# Altium schematic sheet Dash.SchDoc
size 599 x 299 mm
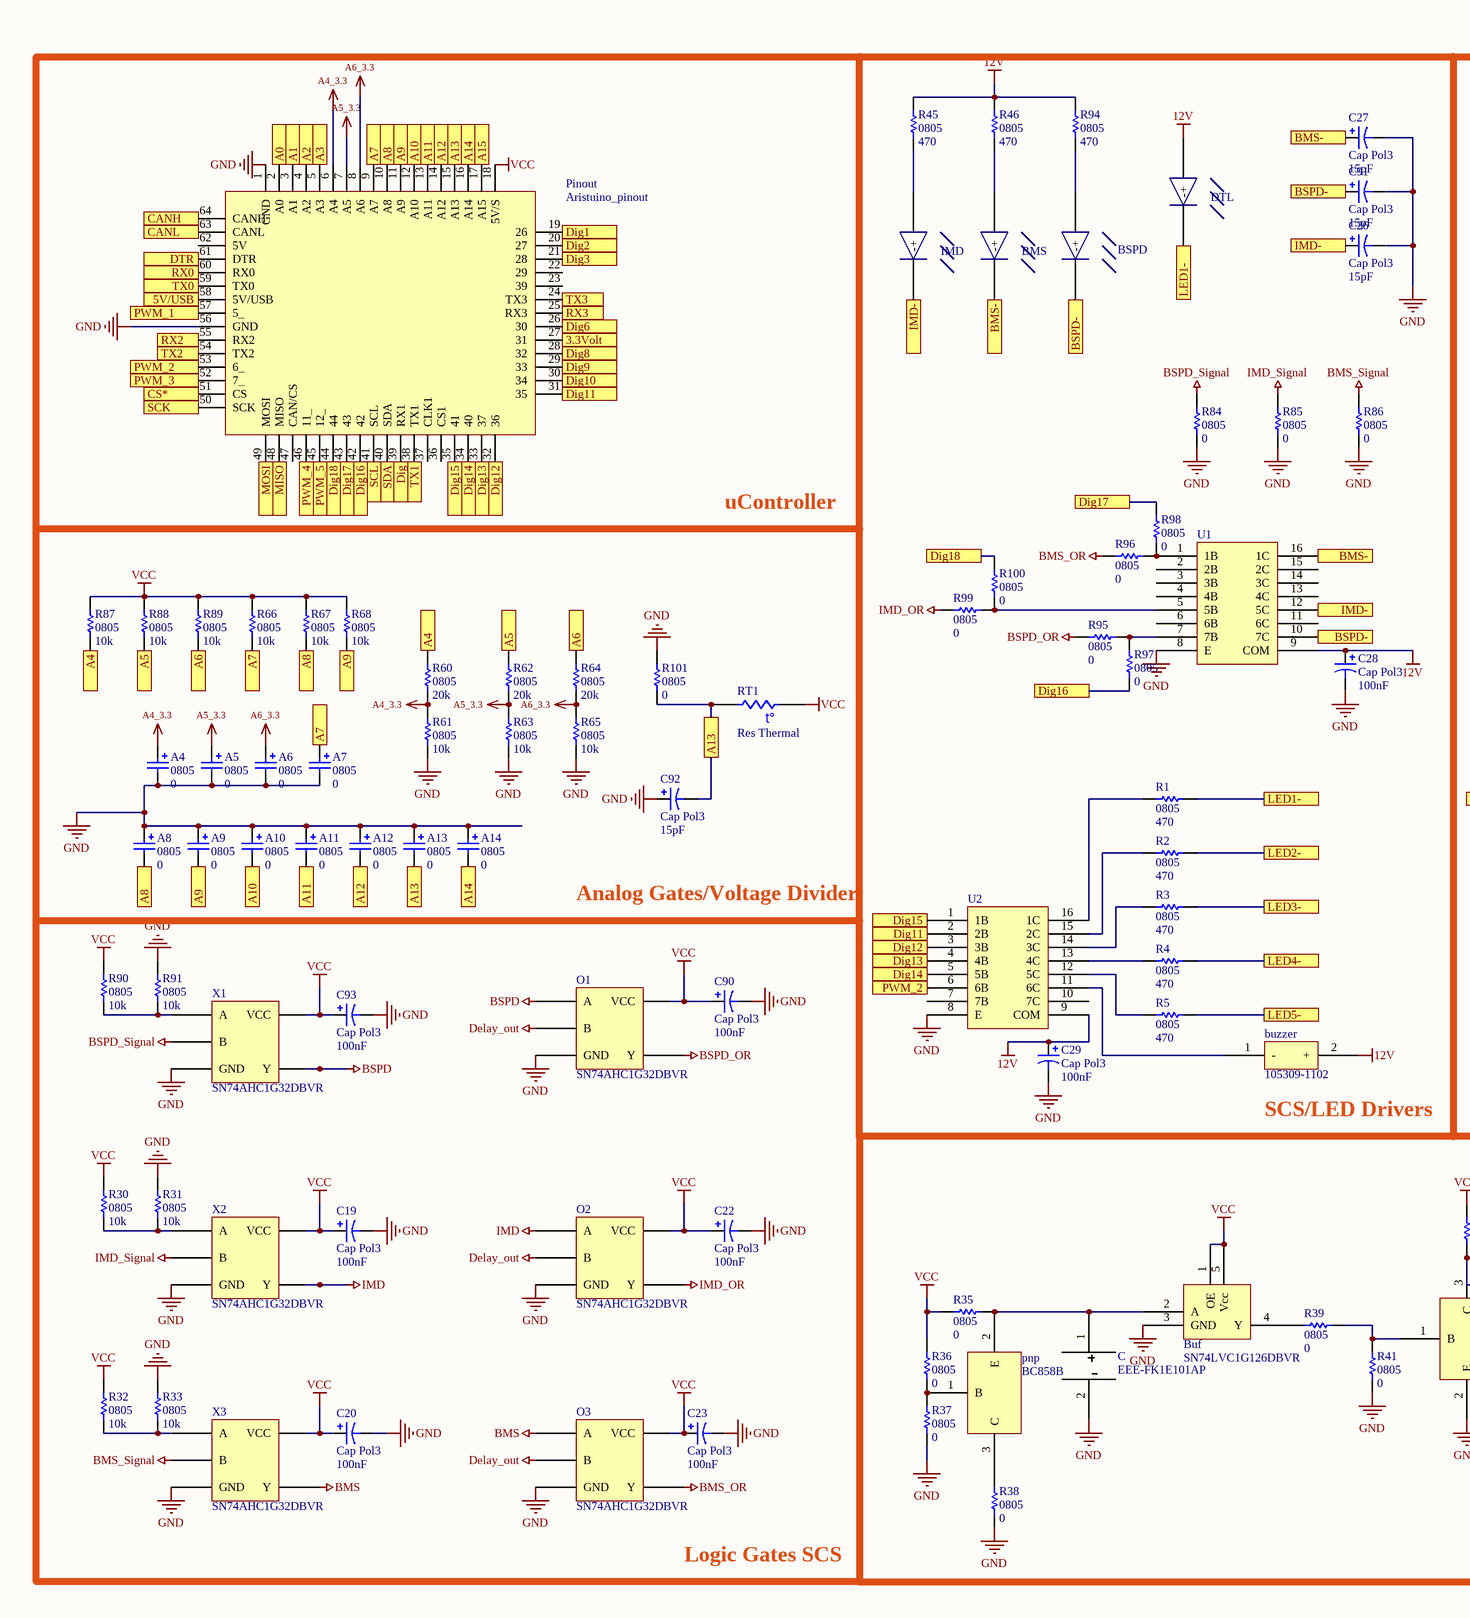
[diagram p0: Dash.SchDoc, left]
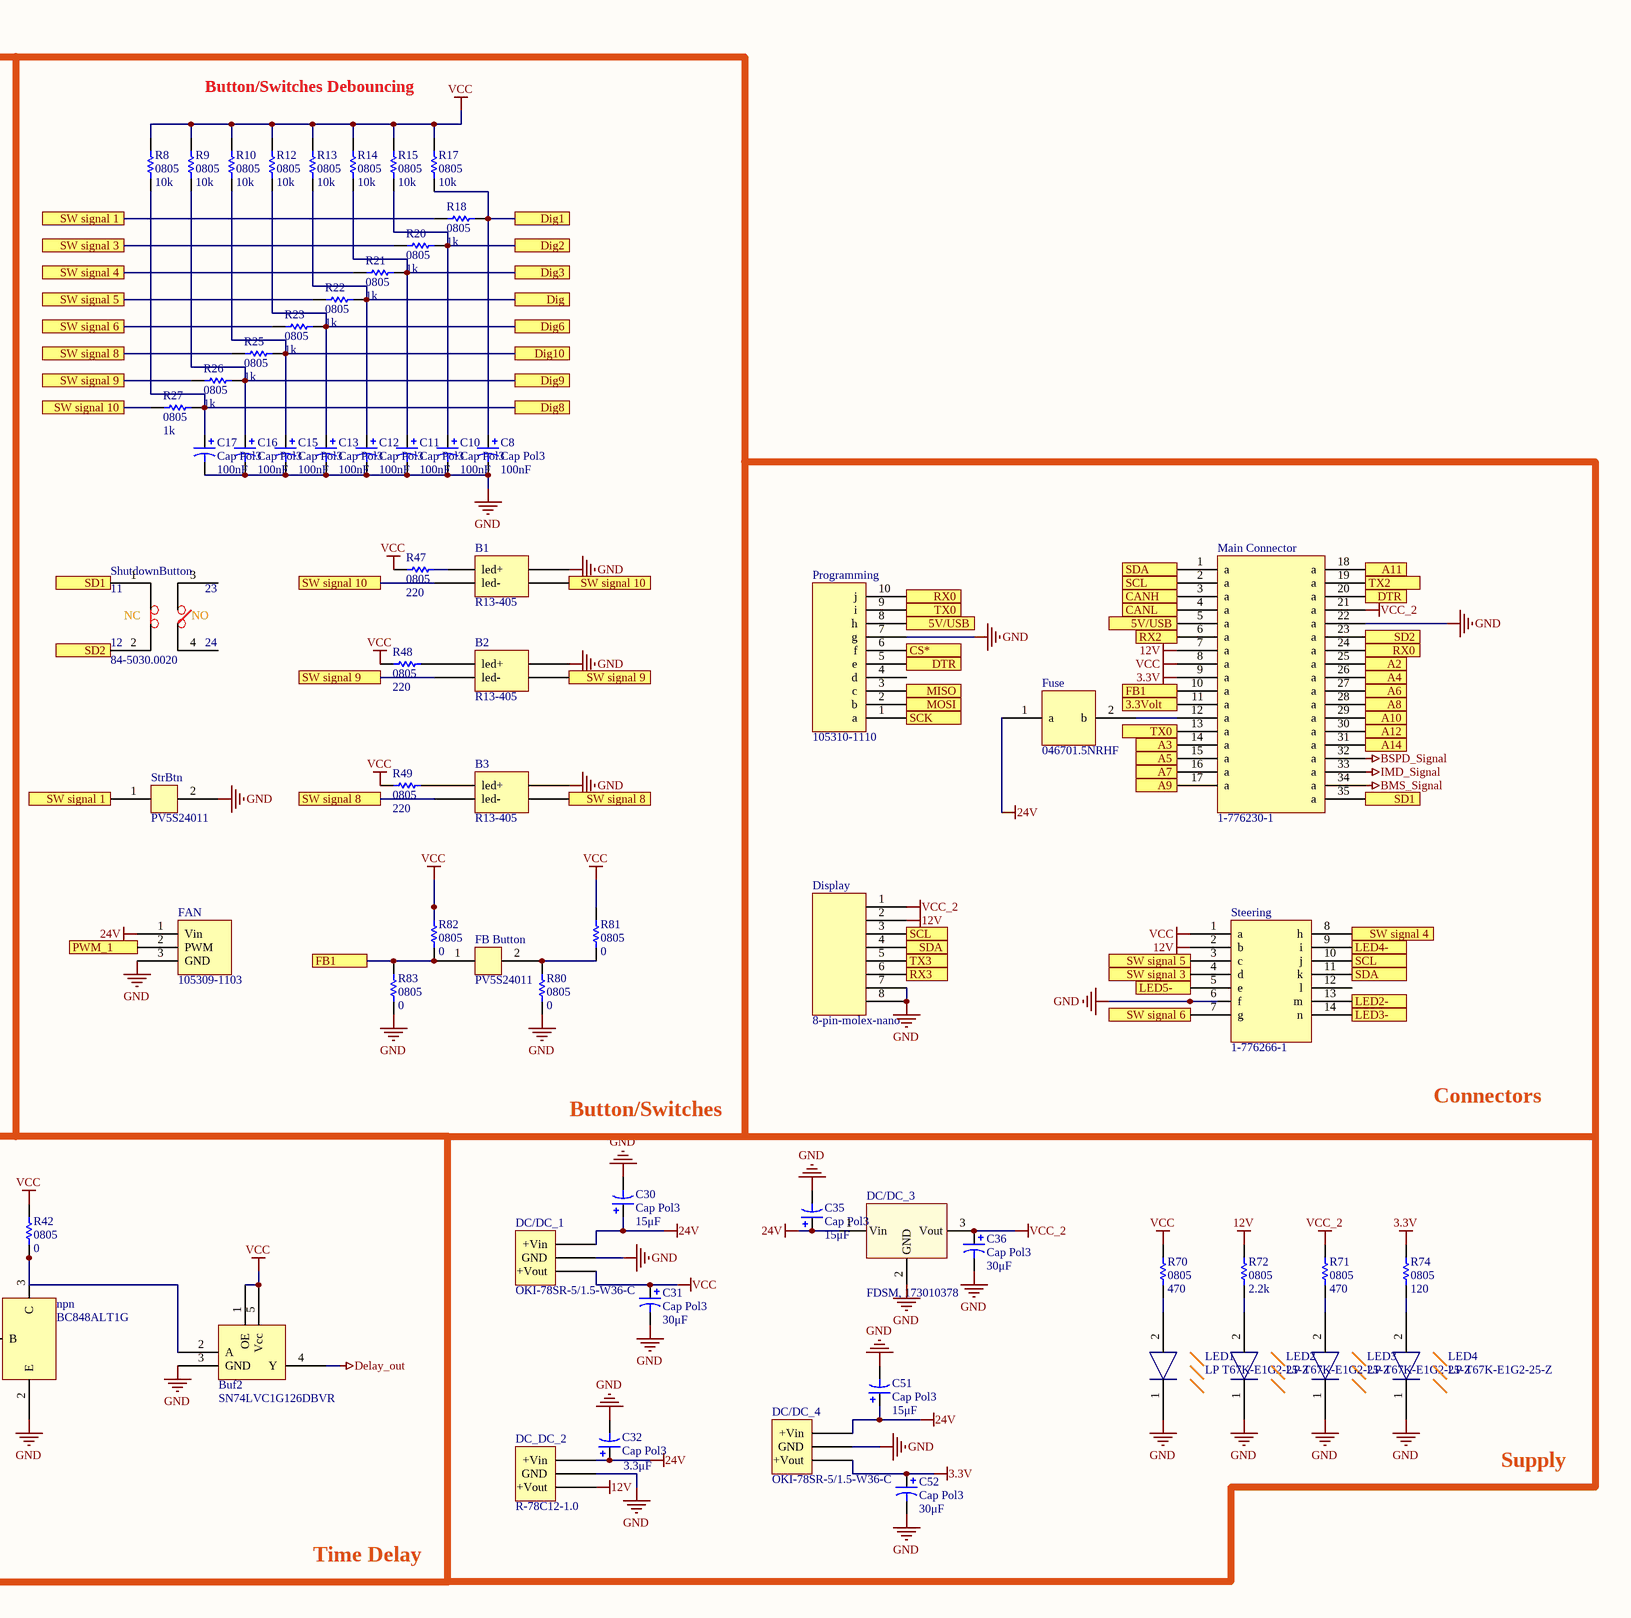
[diagram p1: Dash.SchDoc, right]

## Parts
A4  0805  value 0  [PCBComponent_1]
A5  0805  value 0  [PCBComponent_1]
A6  0805  value 0  [PCBComponent_1]
A7  0805  value 0  [PCBComponent_1]
A8  0805  value 0  [PCBComponent_1]
A9  0805  value 0  [PCBComponent_1]
A10  0805  value 0  [PCBComponent_1]
A11  0805  value 0  [PCBComponent_1]
A12  0805  value 0  [PCBComponent_1]
A13  0805  value 0  [PCBComponent_1]
A14  0805  value 0  [PCBComponent_1]
B1  R13-405  [PCBComponent_1]
B2  R13-405  [PCBComponent_1]
B3  R13-405  [PCBComponent_1]
BMS  LTH3MM12VFR4100  [H_P_LED_?]  (value not drawn)
BSPD  LTH3MM12VFR4100  [H_P_LED_?]  (value not drawn)
Buf  SN74LVC1G126DBVR  [SN74AHC1G32DBVR]
Buf2  SN74LVC1G126DBVR  [SN74AHC1G32DBVR]
buzzer  105309-1102  [PCBComponent_1]
C  EEE-FK1E101AP  [CAPAE7084X65M]
C8  Cap Pol3  value 100nF  [CAPC2012X06N]
C10  Cap Pol3  value 100nF  [CAPC2012X06N]
C11  Cap Pol3  value 100nF  [CAPC2012X06N]
C12  Cap Pol3  value 100nF  [CAPC2012X06N]
C13  Cap Pol3  value 100nF  [CAPC2012X06N]
C15  Cap Pol3  value 100nF  [CAPC2012X06N]
C16  Cap Pol3  value 100nF  [CAPC2012X06N]
C17  Cap Pol3  value 100nF  [CAPC2012X06N]
C19  Cap Pol3  value 100nF  [CAPC2012X06N]
C20  Cap Pol3  value 100nF  [CAPC2012X06N]
C22  Cap Pol3  value 100nF  [CAPC2012X06N]
C23  Cap Pol3  value 100nF  [CAPC2012X06N]
C26  Cap Pol3  value 15pF  [CAPC2012X06N]
C27  Cap Pol3  value 15pF  [CAPC2012X06N]
C28  Cap Pol3  value 100nF  [CAPC2012X06N]
C29  Cap Pol3  value 100nF  [CAPC2012X06N]
C30  Cap Pol3  value 15μF  [CAPC2012X06N]
C31  Cap Pol3  value 30μF  [CAPC2012X06N]
C32  Cap Pol3  value 3.3μF  [CAPC2012X06N]
C35  Cap Pol3  value 15μF  [CAPC2012X06N]
C36  Cap Pol3  value 30μF  [CAPC2012X06N]
C51  Cap Pol3  value 15μF  [CAPC2012X06N]
C52  Cap Pol3  value 30μF  [CAPC2012X06N]
C90  Cap Pol3  value 100nF  [CAPC2012X06N]
C91  Cap Pol3  value 15pF  [CAPC2012X06N]
C92  Cap Pol3  value 15pF  [CAPC2012X06N]
C93  Cap Pol3  value 100nF  [CAPC2012X06N]
DC/DC_1  OKI-78SR-5/1.5-W36-C  [OKI-78SR-5/1.5-W36-C]
DC/DC_3  FDSM, 173010378  [WE-FDSM_173010x78]
DC/DC_4  OKI-78SR-5/1.5-W36-C  [OKI-78SR-5/1.5-W36-C]
DC_DC_2  R-78C12-1.0  [PCBComponent_1]
Display  8-pin-molex-nano  [Molex nano-fit 8pin]
DTL  LTH3MM12VFR4100  [H_P_LED_?]  (value not drawn)
FAN  105309-1103  [FAN?]
FB_Button  PV5S24011  [PV5S24011]
Fuse  046701.5NRHF  [046701.5NRHF]
IMD  LTH3MM12VFR4100  [H_P_LED_?]  (value not drawn)
LED1  LP T67K-E1G2-25-Z  [LP T67K-E1G2-25-Z]
LED2  LP T67K-E1G2-25-Z  [LP T67K-E1G2-25-Z]
LED3  LP T67K-E1G2-25-Z  [LP T67K-E1G2-25-Z]
LED4  LP T67K-E1G2-25-Z  [LP T67K-E1G2-25-Z]
Main_Connector  1-776230-1  [H?]
npn  BC848ALT1G  [NPN BJT]
O1  SN74AHC1G32DBVR  [SN74AHC1G32DBVR]
O2  SN74AHC1G32DBVR  [SN74AHC1G32DBVR]
O3  SN74AHC1G32DBVR  [SN74AHC1G32DBVR]
Pinout  Aristuino_pinout  [18x15 rectangular pin]
pnp  BC858B  [NPN BJT]
Programming  105310-1110  [10pin-molex]
R1  0805  value 470  [RESC2012X06N]
R2  0805  value 470  [RESC2012X06N]
R3  0805  value 470  [RESC2012X06N]
R4  0805  value 470  [RESC2012X06N]
R5  0805  value 470  [RESC2012X06N]
R8  0805  value 10k  [RESC2012X06N]
R9  0805  value 10k  [RESC2012X06N]
R10  0805  value 10k  [RESC2012X06N]
R12  0805  value 10k  [RESC2012X06N]
R13  0805  value 10k  [RESC2012X06N]
R14  0805  value 10k  [RESC2012X06N]
R15  0805  value 10k  [RESC2012X06N]
R17  0805  value 10k  [RESC2012X06N]
R18  0805  value 1k  [RESC2012X06N]
R20  0805  value 1k  [RESC2012X06N]
R21  0805  value 1k  [RESC2012X06N]
R22  0805  value 1k  [RESC2012X06N]
R23  0805  value 1k  [RESC2012X06N]
R25  0805  value 1k  [RESC2012X06N]
R26  0805  value 1k  [RESC2012X06N]
R27  0805  value 1k  [RESC2012X06N]
R30  0805  value 10k  [RESC2012X06N]
R31  0805  value 10k  [RESC2012X06N]
R32  0805  value 10k  [RESC2012X06N]
R33  0805  value 10k  [RESC2012X06N]
R35  0805  value 0  [RESC2012X06N]
R36  0805  value 0  [RESC2012X06N]
R37  0805  value 0  [RESC2012X06N]
R38  0805  value 0  [RESC2012X06N]
R39  0805  value 0  [RESC2012X06N]
R41  0805  value 0  [RESC2012X06N]
R42  0805  value 0  [RESC2012X06N]
R45  0805  value 470  [RESC2012X06N]
R46  0805  value 470  [RESC2012X06N]
R47  0805  value 220  [RESC2012X06N]
R48  0805  value 220  [RESC2012X06N]
R49  0805  value 220  [RESC2012X06N]
R60  0805  value 20k  [RESC2012X06N]
R61  0805  value 10k  [RESC2012X06N]
R62  0805  value 20k  [RESC2012X06N]
R63  0805  value 10k  [RESC2012X06N]
R64  0805  value 20k  [RESC2012X06N]
R65  0805  value 10k  [RESC2012X06N]
R66  0805  value 10k  [RESC2012X06N]
R67  0805  value 10k  [RESC2012X06N]
R68  0805  value 10k  [RESC2012X06N]
R70  0805  value 470  [RESC2012X06N]
R71  0805  value 470  [RESC2012X06N]
R72  0805  value 2.2k  [RESC2012X06N]
R74  0805  value 120  [RESC2012X06N]
R80  0805  value 0  [RESC2012X06N]
R81  0805  value 0  [RESC2012X06N]
R82  0805  value 0  [RESC2012X06N]
R83  0805  value 0  [RESC2012X06N]
R84  0805  value 0  [RESC2012X06N]
R85  0805  value 0  [RESC2012X06N]
R86  0805  value 0  [RESC2012X06N]
R87  0805  value 10k  [RESC2012X06N]
R88  0805  value 10k  [RESC2012X06N]
R89  0805  value 10k  [RESC2012X06N]
R90  0805  value 10k  [RESC2012X06N]
R91  0805  value 10k  [RESC2012X06N]
R94  0805  value 470  [RESC2012X06N]
R95  0805  value 0  [RESC2012X06N]
R96  0805  value 0  [RESC2012X06N]
R97  0805  value 0  [RESC2012X06N]
R98  0805  value 0  [RESC2012X06N]
R99  0805  value 0  [RESC2012X06N]
R100  0805  value 0  [RESC2012X06N]
R101  0805  value 0  [RESC2012X06N]
RT1  Res Thermal  [1608[0603]]
ShutdownButton  84-5030.0020  [ShutDownButton]
Steering  1-776266-1  [PCBComponent_1]
StrBtn  PV5S24011  [PV5S24011]
U1  Darlington Transistors Hi-Vltg Hi-Crnt Darl Transistor Arrays  [ULN2004ADR]  (value not drawn)
U2  Darlington Transistors Hi-Vltg Hi-Crnt Darl Transistor Arrays  [ULN2004ADR]  (value not drawn)
X1  SN74AHC1G32DBVR  [SN74AHC1G32DBVR]
X2  SN74AHC1G32DBVR  [SN74AHC1G32DBVR]
X3  SN74AHC1G32DBVR  [SN74AHC1G32DBVR]

## Ports
3.3Volt, 5V/USB, A0, A1, A2, A3, A4, A5, A6, A7, A8, A9, A10, A11, A12, A13, A14, A15, BMS-, BSPD-, CANH, CANL, CS*, Dig, Dig1, Dig2, Dig3, Dig6, Dig8, Dig9, Dig10, Dig11, Dig12, Dig13, Dig14, Dig15, Dig16, Dig17, Dig18, DTR, FB1, IMD-, LED1-, LED2-, LED3-, LED4-, LED5-, MISO, MOSI, PWM_1, PWM_2, PWM_3, PWM_4, PWM_5, RX0, RX2, RX3, SCK, SCL, SD1, SD2, SDA, SW signal 1, SW signal 3, SW signal 4, SW signal 5, SW signal 6, SW signal 8, SW signal 9, SW signal 10, TX0, TX1, TX2, TX3

## Nets
3.3V: C52.1 DC/DC_4.3(+Vout) Main_Connector.9(a) R74.1
12V: buzzer.2(+) C28.1 C29.1 DC_DC_2.3(+Vout) Display.2 DTL.1(+) Main_Connector.7(a) R45.2 R46.2 R72.1 R94.2 Steering.2(b) U1.9(COM) U2.9(COM)
24V: C30.1 C32.1 C35.1 C51.1 DC/DC_1.1(+Vin) DC/DC_3.1(Vin) DC/DC_4.1(+Vin) DC_DC_2.1(+Vin) FAN.1(Vin) Fuse.1(a)
A4_3.3: A4.1 Pinout.6(A4) R60.2 R61.1
A5_3.3: A5.1 Pinout.7(A5) R62.2 R63.1
A6_3.3: A6.1 Pinout.8(A6) R64.2 R65.1
BMS: O3.1(A) X3.4(Y)
BMS_OR: O3.4(Y) R96.1
BMS_Signal: Main_Connector.34(a) R86.1 X3.2(B)
BSPD: O1.1(A) X1.4(Y)
BSPD_OR: O1.4(Y) R95.1
BSPD_Signal: Main_Connector.32(a) R84.1 X1.2(B)
Delay_out: Buf2.4(Y) O1.2(B) O2.2(B) O3.2(B)
GND: A4.2 A5.2 A6.2 A7.2 A8.1 A9.1 A10.1 A11.1 A12.1 A13.1 A14.1 B1.3 B2.3 B3.3 Buf.3(GND) Buf2.3(GND) C.2 C8.2 C10.2 C11.2 C12.2 C13.2 C15.2 C16.2 C17.2 C19.2 C20.2 C22.2 C23.2 C26.2 C27.2 C28.2 C29.2 C30.2 C31.2 C32.2 C35.2 C36.2 C51.2 C52.2 C90.2 C91.2 C92.1 C93.2 DC/DC_1.2(GND) DC/DC_3.2(GND) DC/DC_4.2(GND) DC_DC_2.2(GND) Display.7 Display.8 FAN.3(GND) LED1.1(+) LED2.1(+) LED3.1(+) LED4.1(+) Main_Connector.22(a) npn.2(E) O1.3(GND) O2.3(GND) O3.3(GND) Pinout.1(GND) Pinout.56(GND) Programming.7(g) R31.1 R33.1 R37.2 R38.2 R41.1 R61.2 R63.2 R65.2 R80.2 R83.2 R84.2 R85.2 R86.2 R91.1 R101.1 Steering.6(f) StrBtn.2 U1.8(E) U2.8(E) X1.3(GND) X2.3(GND) X3.3(GND)
IMD: O2.1(A) X2.4(Y)
IMD_OR: O2.4(Y) R99.2
IMD_Signal: Main_Connector.33(a) R85.1 X2.2(B)
VCC: Buf.1(OE) Buf.5(Vcc) Buf2.1(OE) Buf2.5(Vcc) C19.1 C20.1 C22.1 C23.1 C31.1 C90.1 C93.1 DC/DC_1.3(+Vout) Main_Connector.8(a) O1.5(VCC) O2.5(VCC) O3.5(VCC) Pinout.18(5V/S) R8.2 R9.2 R10.2 R12.2 R13.2 R14.2 R15.2 R17.2 R30.1 R32.1 R35.1 R36.1 R42.1 R47.2 R48.2 R49.2 R66.1 R67.1 R68.1 R70.1 R81.2 R82.2 R87.1 R88.1 R89.1 R90.1 RT1.1 Steering.1(a) X1.5(VCC) X2.5(VCC) X3.5(VCC)
VCC_2: C36.1 DC/DC_3.3(Vout) Display.1 Main_Connector.21(a) R71.1
3.3Volt: Main_Connector.11(a) Pinout.27(31) ; port 3.3Volt
5V/USB: Main_Connector.5(a) Pinout.58(5V/USB) Programming.8(h) ; port 5V/USB
A0: Pinout.2(A0) ; port A0
A1: Pinout.3(A1) ; port A1
A2: Main_Connector.25(a) Pinout.4(A2) ; port A2
A3: Main_Connector.14(a) Pinout.5(A3) ; port A3
A4: Main_Connector.26(a) R60.1 R87.2 ; port A4
A5: Main_Connector.15(a) R62.1 R88.2 ; port A5
A6: Main_Connector.27(a) R64.1 R89.2 ; port A6
A7: A7.1 Main_Connector.16(a) Pinout.9(A7) R66.2 ; port A7
A8: A8.2 Main_Connector.28(a) Pinout.10(A8) R67.2 ; port A8
A9: A9.2 Main_Connector.17(a) Pinout.11(A9) R68.2 ; port A9
A10: A10.2 Main_Connector.29(a) Pinout.12(A10) ; port A10
A11: A11.2 Main_Connector.18(a) Pinout.13(A11) ; port A11
A12: A12.2 Main_Connector.30(a) Pinout.14(A12) ; port A12
A13: A13.2 C92.2 Pinout.15(A13) R101.2 RT1.2 ; port A13
A14: A14.2 Main_Connector.31(a) Pinout.16(A14) ; port A14
A15: Pinout.17(A15) ; port A15
BMS-: BMS.2(-) C27.1 U1.16(1C) ; port BMS-
BSPD-: BSPD.2(-) C91.1 U1.10(7C) ; port BSPD-
CANH: Main_Connector.3(a) Pinout.64(CANH) ; port CANH
CANL: Main_Connector.4(a) Pinout.63(CANL) ; port CANL
CS*: Pinout.51(CS) Programming.6(f) ; port CS*
Dig: C12.1 Pinout.39(RX1) R13.1 R22.1 ; port Dig
Dig1: C8.1 Pinout.19(26) R17.1 R18.1 ; port Dig1
Dig2: C10.1 Pinout.20(27) R15.1 R20.1 ; port Dig2
Dig3: C11.1 Pinout.21(28) R14.1 R21.1 ; port Dig3
Dig6: C13.1 Pinout.26(30) R12.1 R23.1 ; port Dig6
Dig8: C17.1 Pinout.28(32) R8.1 R27.1 ; port Dig8
Dig9: C16.1 Pinout.29(33) R9.1 R26.1 ; port Dig9
Dig10: C15.1 Pinout.30(34) R10.1 R25.1 ; port Dig10
Dig11: Pinout.31(35) U2.2(2B) ; port Dig11
Dig12: Pinout.32(36) U2.3(3B) ; port Dig12
Dig13: Pinout.33(37) U2.4(4B) ; port Dig13
Dig14: Pinout.34(40) U2.5(5B) ; port Dig14
Dig15: Pinout.35(41) U2.1(1B) ; port Dig15
Dig16: Pinout.42 R97.1 ; port Dig16
Dig17: Pinout.43 R98.2 ; port Dig17
Dig18: Pinout.44 R100.1 ; port Dig18
DTR: Main_Connector.20(a) Pinout.61(DTR) Programming.5(e) ; port DTR
FB1: FB_Button.1 Main_Connector.10(a) R82.1 R83.1 ; port FB1
IMD-: C26.1 IMD.2(-) U1.12(5C) ; port IMD-
LED1-: DTL.2(-) R1.2 ; port LED1-
LED2-: R2.2 Steering.13(m) ; port LED2-
LED3-: R3.2 Steering.14(n) ; port LED3-
LED4-: R4.2 Steering.9(i) ; port LED4-
LED5-: R5.2 Steering.5(e) ; port LED5-
MISO: Pinout.48(MISO) Programming.3(c) ; port MISO
MOSI: Pinout.49(MOSI) Programming.2(b) ; port MOSI
PWM_1: FAN.2(PWM) Pinout.57(5_) ; port PWM_1
PWM_2: Pinout.53(6_) U2.6(6B) ; port PWM_2
PWM_3: Pinout.52(7_) ; port PWM_3
PWM_4: Pinout.46(11_) ; port PWM_4
PWM_5: Pinout.45(12_) ; port PWM_5
RX0: Main_Connector.24(a) Pinout.60(RX0) Programming.10(j) ; port RX0
RX2: Main_Connector.6(a) Pinout.55(RX2) ; port RX2
RX3: Display.6 Pinout.25(RX3) ; port RX3
SCK: Pinout.50(SCK) Programming.1(a) ; port SCK
SCL: Display.3 Main_Connector.2(a) Pinout.41(SCL) Steering.10(j) ; port SCL
SD1: Main_Connector.35(a) ShutdownButton.1 ; port SD1
SD2: Main_Connector.23(a) ShutdownButton.2 ; port SD2
SDA: Display.4 Main_Connector.1(a) Pinout.40(SDA) Steering.11(k) ; port SDA
SW signal 1: R18.2 StrBtn.1 ; port SW signal 1
SW signal 3: R20.2 Steering.4(d) ; port SW signal 3
SW signal 4: R21.2 Steering.8(h) ; port SW signal 4
SW signal 5: R22.2 Steering.3(c) ; port SW signal 5
SW signal 6: R23.2 Steering.7(g) ; port SW signal 6
SW signal 8: B3.2(led-) B3.4 R25.2 ; port SW signal 8
SW signal 9: B2.2(led-) B2.4 R26.2 ; port SW signal 9
SW signal 10: B1.2(led-) B1.4 R27.2 ; port SW signal 10
TX0: Main_Connector.13(a) Pinout.59(TX0) Programming.9(i) ; port TX0
TX1: Pinout.38(TX1) ; port TX1
TX2: Main_Connector.19(a) Pinout.54(TX2) ; port TX2
TX3: Display.5 Pinout.24(TX3) ; port TX3
NetB1_1: B1.1(led+) R47.1
NetB2_1: B2.1(led+) R48.1
NetB3_1: B3.1(led+) R49.1
NetBMS_1: BMS.1(+) R46.1
NetBSPD_1: BSPD.1(+) R94.1
NetBuf2_2: Buf2.2(A) npn.3(C) R42.2
NetBuf_2: Buf.2(A) C.1 pnp.2(E) R35.2
NetBuf_4: Buf.4(Y) R39.1
Netbuzzer_1: buzzer.1(-) U2.11(6C)
NetFB_Button_2: FB_Button.2 R80.1 R81.1
NetFuse_2: Fuse.2(b) Main_Connector.12(a)
NetIMD_1: IMD.1(+) R45.1
NetLED1_2: LED1.2(-) R70.2
NetLED2_2: LED2.2(-) R72.2
NetLED3_2: LED3.2(-) R71.2
NetLED4_2: LED4.2(-) R74.2
Netnpn_1: npn.1(B) R39.2 R41.2
Netpnp_1: pnp.1(B) R36.2 R37.1
Netpnp_3: pnp.3(C) R38.1
NetR1_1: R1.1 U2.16(1C)
NetR2_1: R2.1 U2.15(2C)
NetR3_1: R3.1 U2.14(3C)
NetR4_1: R4.1 U2.13(4C)
NetR5_1: R5.1 U2.12(5C)
NetR30_2: R30.2 R31.2 X2.1(A)
NetR32_2: R32.2 R33.2 X3.1(A)
NetR90_2: R90.2 R91.2 X1.1(A)
NetR95_2: R95.2 R97.2 U1.7(7B)
NetR96_2: R96.2 R98.1 U1.1(1B)
NetR99_1: R99.1 R100.2 U1.5(5B)

Not connected (* = marked no-connect by the designer): Pinout 22(29) 23(39) 36(CS1) 37(CLK1) 47(CAN/CS) 62(5V); Programming 4(d); ShutdownButton 3 4; Steering 12(l); U1 2(2B) 3(3B) 4(4B) 6(6B) 11(6C) 13(4C) 14(3C) 15(2C); U2 7(7B) 10(7C)

## Notes on the sheet
- Button/Switches Debouncing
- uController
- Analog Gates/Voltage Divider
- Connectors
- (near buzzer) SCS/LED Drivers
- Button/Switches
- Supply
- Logic Gates SCS
- Time Delay
- (in symbol 84-5030.0020) 11; 23; NC; NO; 12; 24
- (in symbol Res Thermal) t°

## Library data of the parts
A4-A14 = Cap Pol2: Polarized Capacitor (Axial); Published: 8-Jun-2000; LatestRevisionDate: 17-Jul-2002; LatestRevisionNote: Re-released for DXP Platform.; PackageReference: POLAR0.8; Publisher: Altium Limited; PackageDescription: Polarized Capacitor; 2 Leads
B1-B3 O1-O3 U1 U2 X1-X3 = Component_1
BMS BSPD DTL IMD = Component_1: Standard LEDs - Through Hole 3mm Thru Hole LED 625nm for 12VDC
Buf Buf2 = SN74LVC1G126DBVR: Buffers & Line Drivers Single Bus Buffer
buzzer = U: Nano-Fit Vertical Header, Through Hole, 2.50mm Pitch, Single Row, 2 Circuits, with Kinked Pins, Tin (Sn) Plating, Black
C = EEE-FK1E101AP: Aluminium Electrolytic Capacitors - SMD 100UF 25V FK SMD
C8 C10-C13 C15-C17 C19 C20 C22 C23 C26-C32 C35 C36 C51 C52 C90-C93 = Cap Pol3: Polarized Capacitor (Surface Mount); Published: 8-Jun-2000; LatestRevisionDate: 29-May-2009; LatestRevisionNote: IPC-7351 Footprint Added.; PackageReference: C0805; Publisher: Altium Limited; PackageDescription: Chip Capacitor
DC/DC_1 DC/DC_4 = Component_1: Non-Isolated DC/DC Converters 7.5W 24Vin 5Vout1 1.5A SIP Non-Iso
DC/DC_3 = FDSM, 173010378: MagI³C-FDSM Fixed Step Down Regulator Module; InputVoltage: 7-28V; OutputCurrent: 1A; PublishedDate: Aug 2016; Publisher: Wurth Elektronik; ComponentLink1Description: Manufacturer; ComponentLink1URL: http://www.we-online.de; ComponentLink2Description: Datasheet; ComponentLink2URL: http://katalog.we-online.de/pm/datasheet/173010378.pdf; PartNumber: 173010378; Size: SIP-3
DC_DC_2 = Component_1: Non-Isolated DC/DC Converters CONV DC/DC 1A 15-42VIN 12VOUT
FAN = Component_1: Nano-Fit Vertical Header, Through Hole, 2.50mm Pitch, Single Row, 3 Circuits, with Kinked Pins, Tin (Sn) Plating, Black
FB_Button StrBtn = Component_1: Pushbutton Switches 0-2A 48VDC Off (On) 12mm Black Domed
Fuse = 046701.5NRHF: Surface Mount Fuses 32V 1.5 A V/FA HALIDE FREE
LED1-LED4 = Component_1: Standard LEDs - SMD Pure Green, 560nm 2.8mcd, 2mA
Main_Connector = Component_1: HEADER ASSY, 35 POS VERTICAL
npn = Component_1: Bipolar Transistors - BJT 100mA 30V NPN
pnp = Component_1: Bipolar Transistors - BJT Transistor 200mW
Programming = Component_1: Nano-Fit Vertical Header, Through Hole, 2.50mm Pitch, Dual Row, 10 Circuits, with Kinked Pins, Tin (Sn) Plating, Black
R1-R5 R8-R10 R12-R15 R17 R18 R20-R23 R25-R27 R30-R33 R35-R39 R41 R42 R45-R49 R60-R68 R70-R72 R74 R80-R91 R94-R101 = ERJ6RB: Precision Thick Film Chip Resistor, 10 Ohm to 1M Ohm Range, 1% and 0.5% Tolerance, 0805 Size, 0.1 W; Published: 17-Dec-2003; LatestRevisionDate: 19-Mar-2004; LatestRevisionNote: Silkscreen size reduced.; PackageDocument: Mar-2003; PackageReference: 6-0805; Publisher: Altium Limited; Code_IPC: 2012 [0805]; ComponentLink1Description: Manufacturer Link; ComponentLink1URL: http://www.panasonic.com/industrial/components/resistive_products.htm; ComponentLink2Description: Datasheet; ComponentLink2URL: http://www.panasonic.com/industrial/components/pdf/AOA0000CE2.pdf
RT1 = Res Thermal: Thermistor; Published: 24-Mar-1999; LatestRevisionDate: 29-May-2009; LatestRevisionNote: IPC-7351 Footprint Added.; PackageVersion: Mar-2003; PackageReference: 6-0805; Publisher: Altium Limited; PackageDescription: Chip Resistor 0805 Case Size; Code_IPC: RESC2012
Steering = Component_1: 14 POS RIGHT ANGLE HEADER ASSY